# Altium schematic sheet Solder Training Tier 3.SchDoc
size A; SheetNumber: 1; SheetTotal: 1
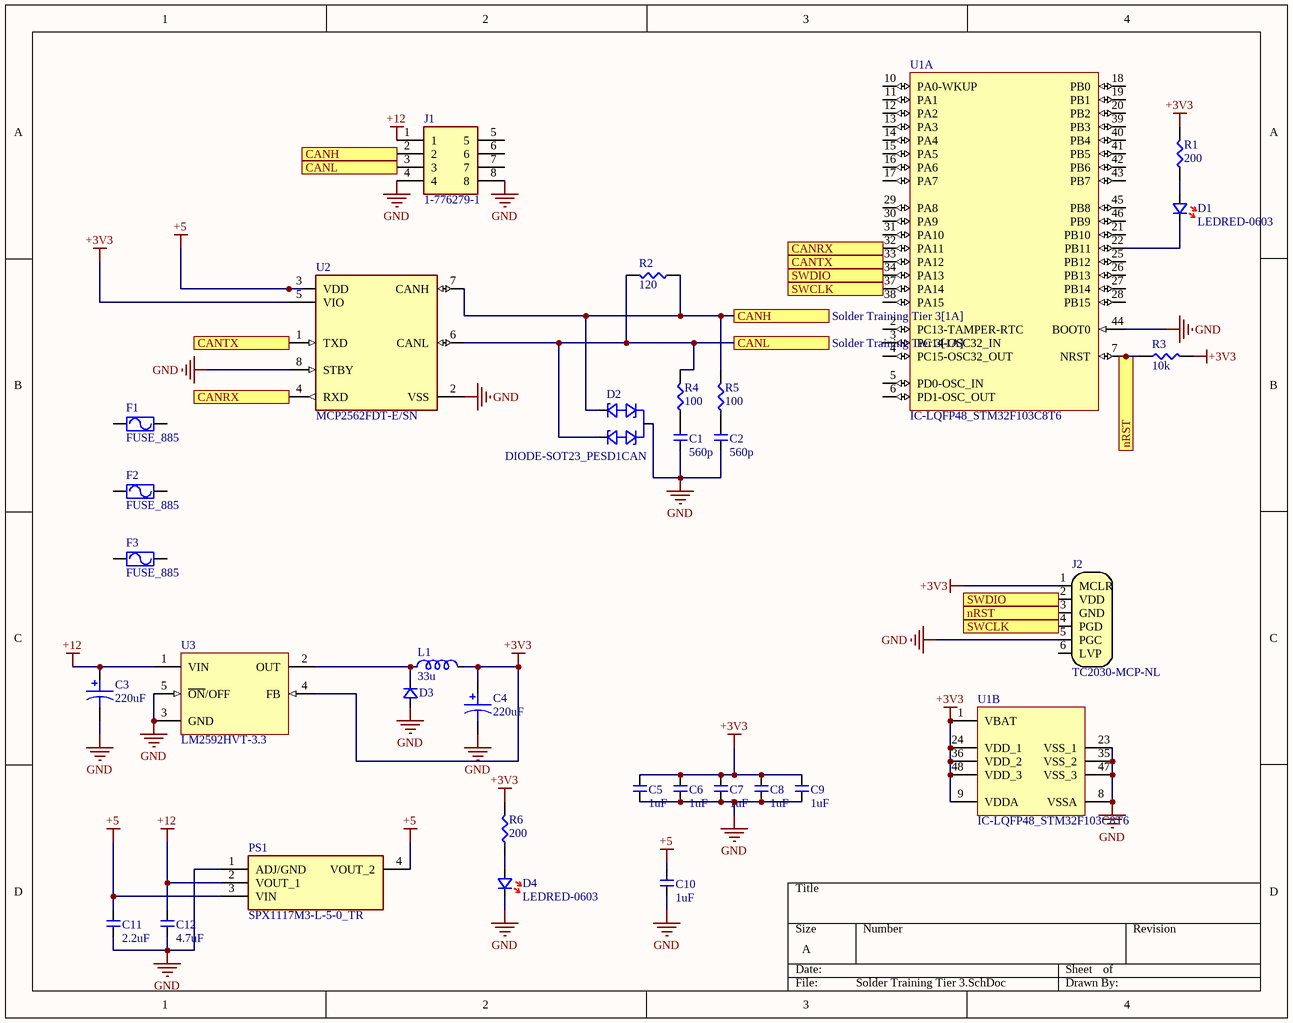
[diagram p0: Solder Training Tier 3.SchDoc]

## Parts
C1  560p  [CAP-0603]
C2  560p  [CAP-0603]
C3  220uF  [CAP-6.3D7.7H-SMD]
C4  220uF  [CAP-6.3D7.7H-SMD]
C5  1uF  [CAP-0603]
C6  1uF  [CAP-0603]
C7  1uF  [CAP-0603]
C8  1uF  [CAP-0603]
C9  1uF  [CAP-0603]
C10  1uF  [CAP-0603]
C11  2.2uF  [CAP-0603]
C12  4.7uF  [CAP-0603]
D1  LEDRED-0603  [LEDRED-0603]
D2  DIODE-SOT23_PESD1CAN  [SOT23]
D3  (no value)  [SOD123]
D4  LEDRED-0603  [LEDRED-0603]
F1  FUSE_885  [FUSE_885]
F2  FUSE_885  [FUSE_885]
F3  FUSE_885  [FUSE_885]
J1  1-776279-1  [17762791]
J2  TC2030-MCP-NL  [TC2030-MCP-NL]  (no BOM)
L1  33u  [IND-6045]
PS1  SPX1117M3-L-5-0_TR  [SOT230P700X170-4N]
R1  200  [RES-0603]
R2  120  [RES-0603]
R3  10k  [RES-0603]
R4  100  [RES-0603]
R5  100  [RES-0603]
R6  200  [RES-0603]
U1  IC-LQFP48_STM32F103C8T6  [STM-LQFP48_M]  (parts A,B of 2)
U2  MCP2562FDT-E/SN  [FP-C04-057-SN-MFG]
U3  LM2592HVT-3.3  [T05D]

## Ports
CANH (see Solder Training Tier 3[1A]), CANH (see Solder Training Tier 3[3B]), CANL (see Solder Training Tier 3[1A]), CANL (see Solder Training Tier 3[3B]), CANRX (see Solder Training Tier 3[1B]), CANRX (see Solder Training Tier 3[3A]), CANTX (see Solder Training Tier 3[1B]), CANTX (see Solder Training Tier 3[3B]), nRST (see Solder Training Tier 3[3C]), nRST (see Solder Training Tier 3[4B]), SWCLK (see Solder Training Tier 3[3B]), SWCLK (see Solder Training Tier 3[3C]), SWDIO (see Solder Training Tier 3[3B]), SWDIO (see Solder Training Tier 3[3C])

## Nets
+3V3: C4.POS(+) C5.2 C6.2 C7.2 C8.2 C9.2 J2.1(MCLR) L1.2 R1.2 R3.2 R6.2 U1.1(VBAT) U1.9(VDDA) U1.24(VDD_1) U1.36(VDD_2) U1.48(VDD_3) U2.5(VIO) U3.4(FB)
+5: C10.2 C11.2 PS1.3(VIN) PS1.4(VOUT_2) U2.3(VDD)
+12: C3.POS(+) C12.2 J1.1 PS1.2(VOUT_1) U3.1(VIN)
GND: C1.1 C2.1 C3.NEG(-) C4.NEG(-) C5.1 C6.1 C7.1 C8.1 C9.1 C10.1 C11.1 C12.1 D2.3(G) D3.A D4.K J1.4 J1.8 J2.5(PGC) PS1.1(ADJ/GND) U1.8(VSSA) U1.23(VSS_1) U1.35(VSS_2) U1.44(BOOT0) U1.47(VSS_3) U2.2(VSS) U2.8(STBY) U3.3(GND) U3.5(~{ON}/OFF)
CANH: D2.1(CAN1) J1.2 R2.1 R5.2 U2.7(CANH) ; port CANH
CANL: D2.2(CAN2) J1.3 R2.2 R4.2 U2.6(CANL) ; port CANL
CANRX: U1.32(PA11) U2.4(RXD) ; port CANRX
CANTX: U1.33(PA12) U2.1(TXD) ; port CANTX
nRST: J2.3(GND) R3.1 U1.7(NRST) ; port nRST
SWCLK: J2.4(PGD) U1.37(PA14) ; port SWCLK
SWDIO: J2.2(VDD) U1.34(PA13) ; port SWDIO
NetC1_2: C1.2 R4.1
NetC2_2: C2.2 R5.1
NetD1_A: D1.A R1.1
NetD1_K: D1.K U1.22(PB11)
NetD3_K: D3.K L1.1 U3.2(OUT)
NetD4_A: D4.A R6.1

Not connected (* = marked no-connect by the designer): F1 1 2; F2 1 2; F3 1 2; J1 5 6 7; J2 6(LVP); U1 2(PC13-TAMPER-RTC) 3(PC14-OSC32_IN) 4(PC15-OSC32_OUT) 5(PD0-OSC_IN) 6(PD1-OSC_OUT) 10(PA0-WKUP) 11(PA1) 12(PA2) 13(PA3) 14(PA4) 15(PA5) 16(PA6) 17(PA7) 18(PB0) 19(PB1) 20(PB2) 21(PB10) 25(PB12) 26(PB13) 27(PB14) 28(PB15) 29(PA8) 30(PA9) 31(PA10) 38(PA15) 39(PB3) 40(PB4) 41(PB5) 42(PB6) 43(PB7) 45(PB8) 46(PB9)

## Library data of the parts
C1 C2 C5-C12 = CMP-009-000303-1: Source: ife19_Elec_Library.SchLib; Design Item ID: CAP-0603
C3 C4 = CMP-003-000764-1: Source: ife19_Elec_Library.SchLib; Design Item ID: CAP-6.3D7.7H-SMD
D1 D4 = CMP-009-000189-1: Design Item ID: LEDRED-0603; Source: ife19_Elec_Library.SchLib
D2 = CMP-006-000028-1: Design Item ID: DIODE-SOT23_PESD1CAN; Source: ife19_Elec_Library.SchLib
D3 = CMP-010-000008-1: Design Item ID: DIODE-SOD123; Source: ife19_Elec_Library.SchLib
F1-F3 = CMP-011-000003-1: Source: ife19_Elec_Library.SchLib; Design Item ID: FUSE_885
J1 = CMP-038-000007-1: Connector; Manufacturer_Name: TE Connectivity; Height: 32.1mm; Source: SamacSys.SchLib; Arrow Part Number: 1-776279-1; Mouser Part Number: 571-1-776279-1; Mouser Price/Stock: https://www.mouser.co.uk/ProductDetail/TE-Connectivity/1-776279-1?qs=tLAa1RwIH6fAW8GUe6Xfuw%3D%3D; Datasheet Link: https://www.te.com/commerce/DocumentDelivery/DDEController?Action=showdoc&DocId=Customer+Drawing%7F776279%7FF7%7Fpdf%7FEnglish%7FENG_CD_776279_F7.pdf%7F1-776279-1; Manufacturer_Part_Number: 1-776279-1; Design Item ID: 1-776279-1; Arrow Price/Stock: https://www.arrow.com/en/products/1-776279-1/te-connectivity
J2 = CMP-003-000769-1: Conector par ICD; Design Item ID: TC2030-MCP-NL; Source: Image Pasted at 2021-10-31 17-08.SchLib
L1 = CMP-011-000044-1: Design Item ID: IND-6045; Source: ife19_Elec_Library.SchLib
PS1 = CMP-042-000000-1: Power Supply; Manufacturer_Name: EXAR; Manufacturer_Part_Number: SPX1117M3-L-5-0/TR; Arrow Part Number: SPX1117M3-L-5-0/TR; Arrow Price/Stock: https://www.arrow.com/en/products/spx1117m3-l-5-0tr/exar; Mouser Price/Stock: https://www.mouser.com/Search/Refine.aspx?Keyword=701-SPX1117M3-L-50TR; Height: 1.7mm; Design Item ID: SPX1117M3-L-5-0_TR; Datasheet Link: https://datasheet.datasheetarchive.com/originals/distributors/Datasheets-DGA25/1769206.pdf; Mouser Part Number: 701-SPX1117M3-L-50TR; Source: SamacSys.SchLib
R1 R2 R4-R6 = CMP-014-000032-1: Source: ife19_Elec_Library.SchLib; Design Item ID: RES-0603
R3 = CMP-008-000144-1: Design Item ID: RES-0603; Source: ife19_Elec_Library.schlib
U1 = CMP-009-000216-1: Operating Frequency(F) (Processor speed) (MHz): 72; Packing: Tray; Core: ARM Cortex-M3; A/D Converter: 2x12-bit (10 Channel); Supply Voltage(Vcc) min (V): 2; I/Os (High Current): 37; FLASH Size (Prog) (kB): 64; Internal RAM Size (kB): 20; PartNumber: STM32F103C8T6; ComponentLink1Description: Manufacturer URL; ComponentLink1URL: http://www.st.com/web/en/home.html; ComponentLink3URL: http://www.st.com/st-web-ui/static/active/en/resource/technical/document/datasheet/DM00058181.pdf; PackageReference: LQFP48; ComponentLink2Description: Datasheet; Source: ife19_Elec_Library.SchLib; PackageDescription: 48-Pin Low Profile Quad Flat Package, 7 x 7 mm Body, 0.5 mm Pitch; Design Item ID: IC-LQFP48_STM32F103C8T6; ComponentLink3Description: Package Specification; DatasheetVersion: Rev. 16; ComponentLink2URL: http://www.st.com/st-web-ui/static/active/en/resource/technical/document/datasheet/CD00161566.pdf; Mounting Technology: Surface Mount; PackageVersion: Rev. 6, 06/2013
U2 = CMP-06279-000005-1: IC TRANSCEIVER 1/1 8SOIC; Operating Supply Current: 70mA; Data Rate: 8Mbps; Number of Transceivers: 1; Receiver Hysteresis: 200mV; Max Supply Voltage: 5.5V; Min Supply Voltage: 4.5V; Weight: 0.019048oz; Package Quantity: 3300; Case/Package: SOIC; Mount: Surface Mount; Max Operating Temperature: 125°C; Min Operating Temperature: -40°C; Packaging: Tape and Reel; Number of Pins: 8
U3 = CMP-0069-01883-2: SIMPLE SWITCHER® Power Converter 150 KHz 2A Step-Down Voltage Regulator, 5-pin TO-220; Manufacturer: National Semiconductor; PackageTopMarking: NSUZXYTTE#*LM2592HVT*-3.3 P+; PowerWise: N; ComponentLink3Description: T05D Package Page; PackageReference: T05D; DatasheetVersion: Aug-2001; RoHS: N; PackageDescription: TO-220, Molded, Stagger Bend, 5 Lead; ComponentLink2Description: LM2592HV Web Page; RevisionNote: Component URLs added; ComponentLink2URL: http://www.national.com/pf/LM/LM2592HV.html; CompType: Switcher; ComponentLink1Description: LM2592HV Datasheet; PinCount: 5; ComponentLink1URL: http://www.national.com/ds/LM/LM2592HV.pdf; PackageVersion: revA, Oct-1989; ComponentLink3URL: http://www.national.com/packaging/folders/t05d.html